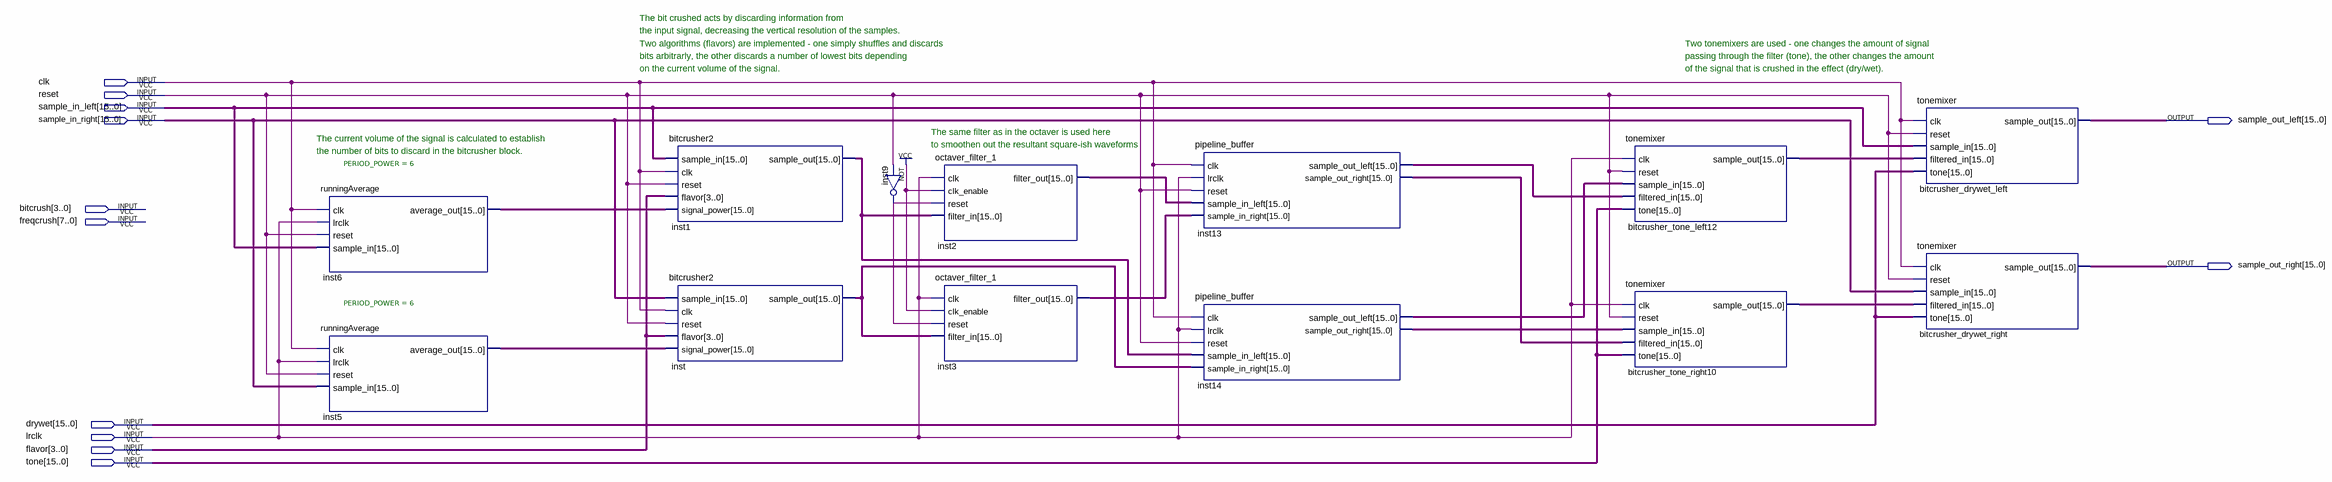
[diagram p0: schematic sheet]
// Quartus schematic bitcrusher_block.bdf as structural Verilog: 13 symbols, 12 pins
module bitcrusher_block (
  input  clk,
  input  reset,
  input  [15:0] sample_in_left,
  input  [15:0] sample_in_right,
  input  [3:0] bitcrush,
  input  [7:0] freqcrush,
  input  [15:0] drywet,
  input  lrclk,
  input  [3:0] flavor,
  input  [15:0] tone,
  output [15:0] sample_out_left,
  output [15:0] sample_out_right
);

  wire inst9_out;
  wire [15:0] bitcrusher_tone_left12_sample_out, bitcrusher_tone_right10_sample_out, inst1_sample_out,
       inst2_filter_out, inst3_filter_out, inst5_average_out, inst6_average_out, inst13_sample_out_left,
       inst13_sample_out_right, inst14_sample_out_left, inst14_sample_out_right, inst_sample_out;

  runningAverage #(.PERIOD_POWER(6)) inst6 (
    .clk(clk), .lrclk(lrclk), .reset(reset), .sample_in(sample_in_left), .average_out(inst6_average_out));
  runningAverage #(.PERIOD_POWER(6)) inst5 (
    .clk(clk), .lrclk(lrclk), .reset(reset), .sample_in(sample_in_right), .average_out(inst5_average_out));
  bitcrusher2 inst1 (
    .sample_in(sample_in_left), .clk(clk), .reset(reset), .flavor(flavor), .signal_power(inst6_average_out),
    .sample_out(inst1_sample_out));
  bitcrusher2 inst (
    .sample_in(sample_in_right), .clk(clk), .reset(reset), .flavor(flavor), .signal_power(inst5_average_out),
    .sample_out(inst_sample_out));
  not inst9 (inst9_out, reset);
  octaver_filter_1 inst2 (
    .clk(lrclk), .clk_enable(1'b1), .reset(inst9_out), .filter_in(inst1_sample_out),
    .filter_out(inst2_filter_out));
  octaver_filter_1 inst3 (
    .clk(lrclk), .clk_enable(1'b1), .reset(inst9_out), .filter_in(inst_sample_out),
    .filter_out(inst3_filter_out));
  pipeline_buffer inst13 (
    .clk(clk), .lrclk(lrclk), .reset(reset), .sample_in_left(inst2_filter_out),
    .sample_in_right(inst3_filter_out), .sample_out_left(inst13_sample_out_left),
    .sample_out_right(inst13_sample_out_right));
  pipeline_buffer inst14 (
    .clk(clk), .lrclk(lrclk), .reset(reset), .sample_in_left(inst1_sample_out),
    .sample_in_right(inst_sample_out), .sample_out_left(inst14_sample_out_left),
    .sample_out_right(inst14_sample_out_right));
  tonemixer bitcrusher_tone_left12 (
    .clk(lrclk), .reset(reset), .sample_in(inst14_sample_out_left), .filtered_in(inst13_sample_out_left),
    .tone(tone), .sample_out(bitcrusher_tone_left12_sample_out));
  tonemixer bitcrusher_tone_right10 (
    .clk(lrclk), .reset(reset), .sample_in(inst14_sample_out_right), .filtered_in(inst13_sample_out_right),
    .tone(tone), .sample_out(bitcrusher_tone_right10_sample_out));
  tonemixer bitcrusher_drywet_left (
    .clk(clk), .reset(reset), .sample_in(sample_in_left), .filtered_in(bitcrusher_tone_left12_sample_out),
    .tone(drywet), .sample_out(sample_out_left));
  tonemixer bitcrusher_drywet_right (
    .clk(clk), .reset(reset), .sample_in(sample_in_right), .filtered_in(bitcrusher_tone_right10_sample_out),
    .tone(drywet), .sample_out(sample_out_right));

  // Notes on the sheet:
  //   The bit crushed acts by discarding information from
  //   the input signal, decreasing the vertical resolution of the samples.
  //   Two algorithms (flavors) are implemented - one simply shuffles and discards
  //   Two tonemixers are used - one changes the amount of signal
  //   bits arbitrarly, the other discards a number of lowest bits depending
  //   passing through the filter (tone), the other changes the amount
  //   on the current volume of the signal.
  //   of the signal that is crushed in the effect (dry/wet).
  //   The same filter as in the octaver is used here
  //   The current volume of the signal is calculated to establish
  //   to smoothen out the resultant square-ish waveforms
  //   the number of bits to discard in the bitcrusher block.
endmodule
